# Altium schematic sheet StepperMotorController_Ver_0.1.SchDoc
size A3
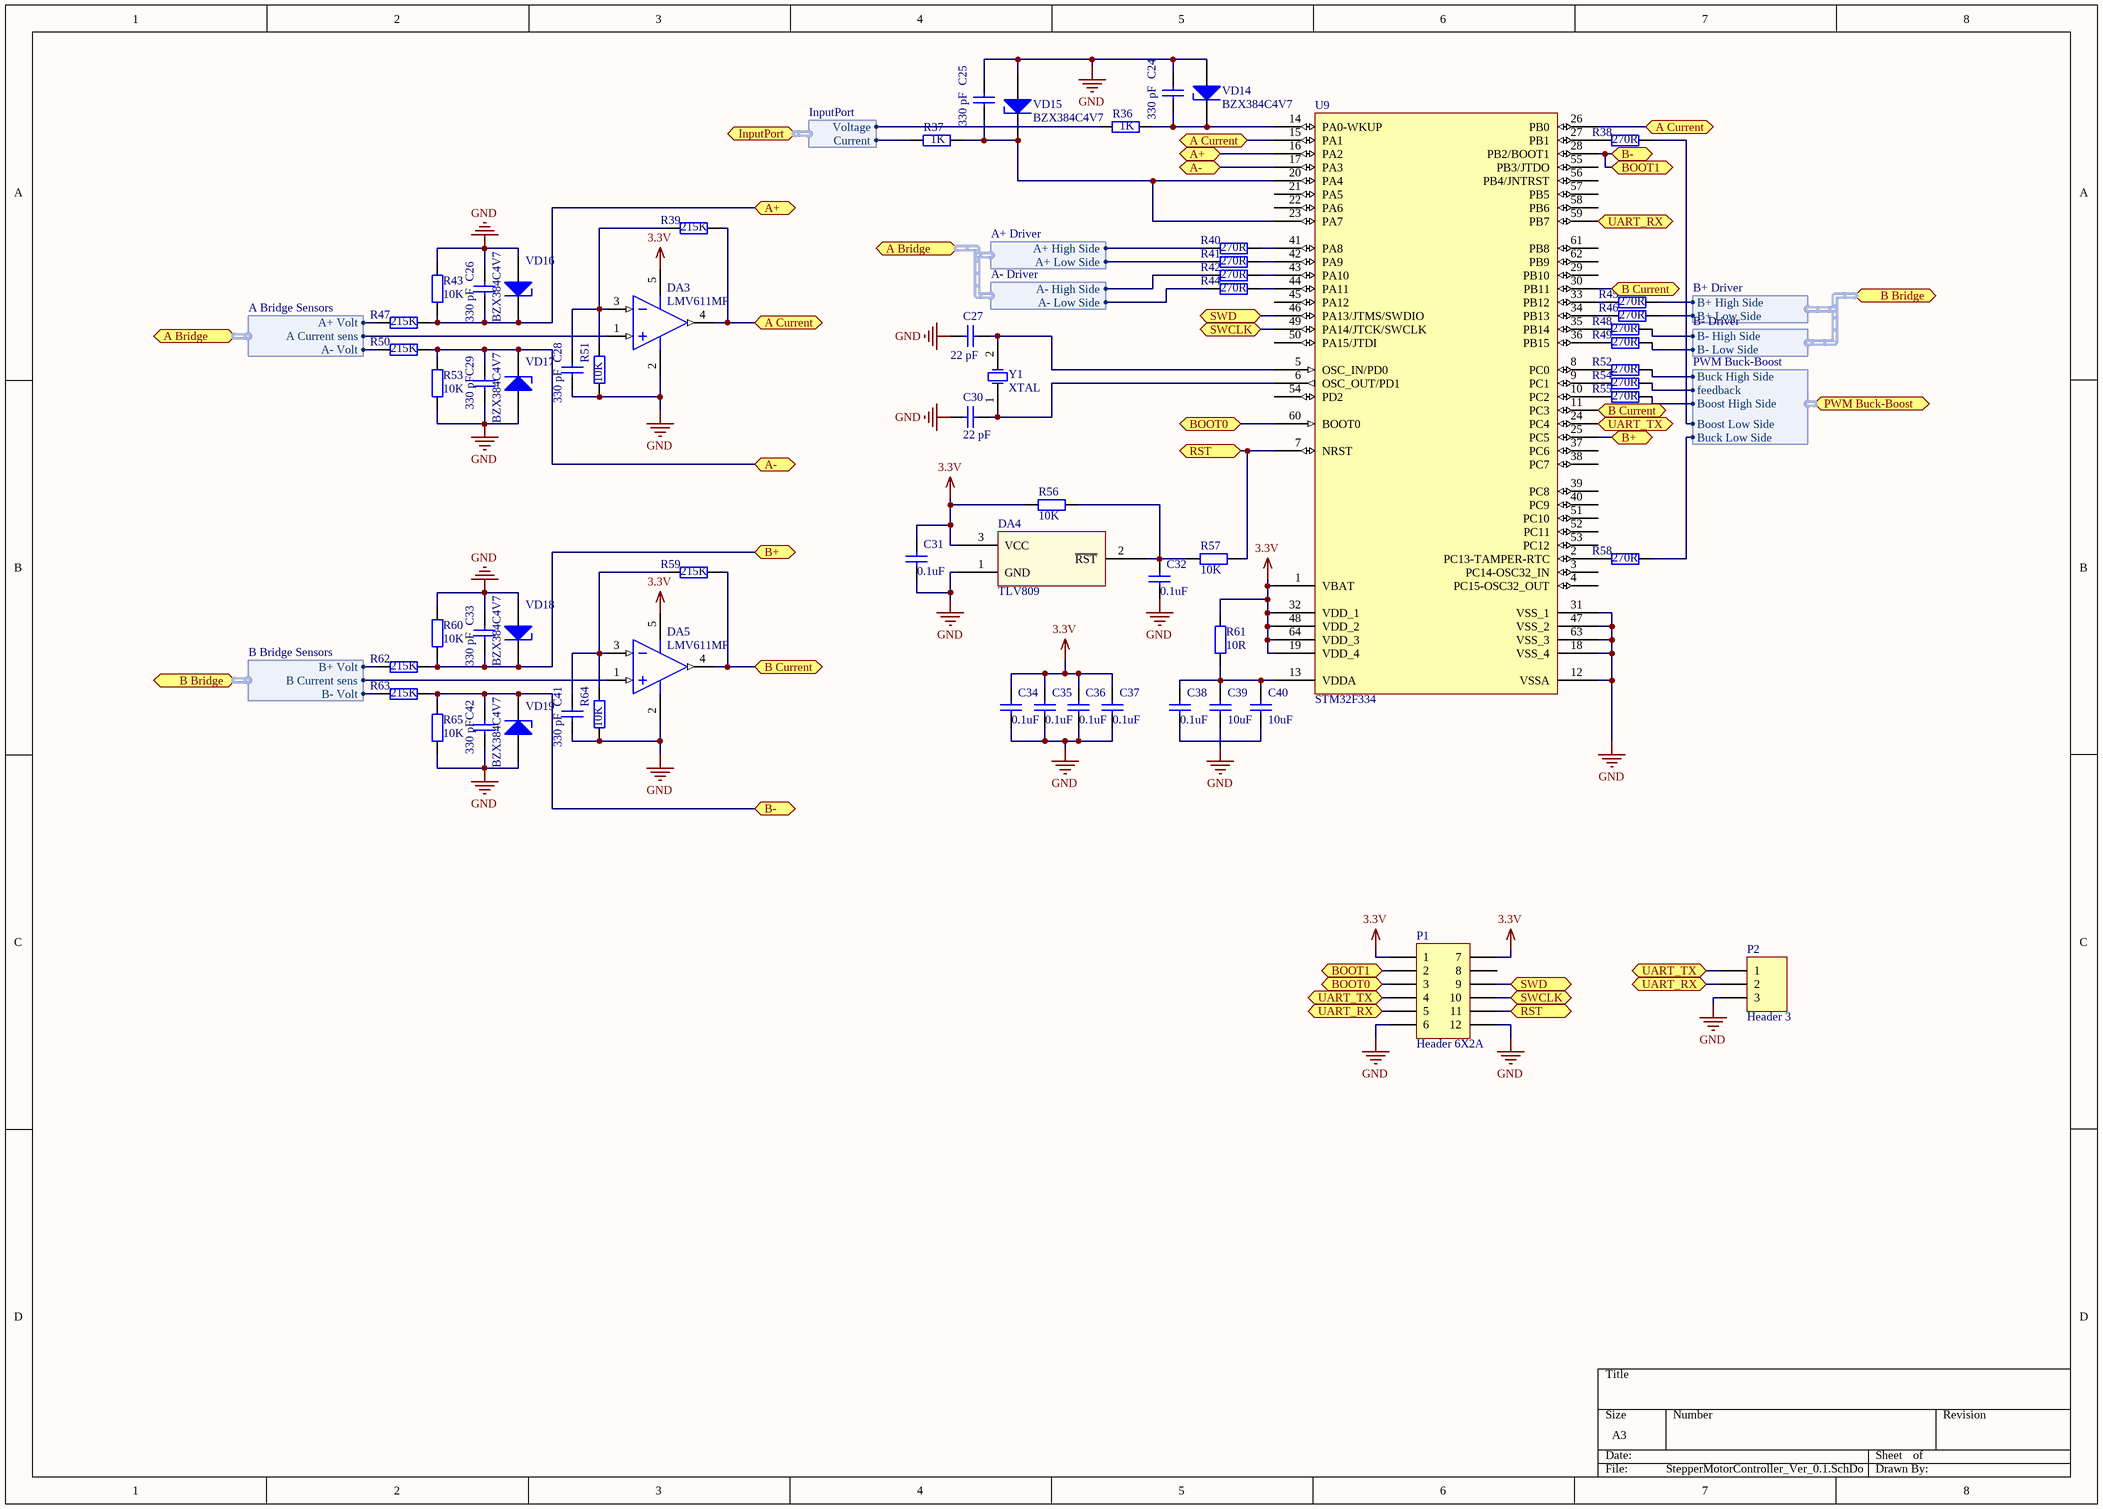
[diagram p0: StepperMotorController_Ver_0.1.SchDoc]

## Parts
C24  value 330 pF  [1608[0603]]  (hidden comment: Capacitor)
C25  value 330 pF  [1608[0603]]  (hidden comment: Capacitor)
C26  value 330 pF  [1608[0603]]  (hidden comment: Capacitor)
C27  value 22 pF  [1608[0603]]  (hidden comment: Capacitor)
C28  value 330 pF  [1608[0603]]  (hidden comment: Capacitor)
C29  value 330 pF  [1608[0603]]  (hidden comment: Capacitor)
C30  value 22 pF  [1608[0603]]  (hidden comment: Capacitor)
C31  value 0.1uF  [1608[0603]]  (hidden comment: Capacitor)
C32  value 0.1uF  [1608[0603]]  (hidden comment: Capacitor)
C33  value 330 pF  [1608[0603]]  (hidden comment: Capacitor)
C34  value 0.1uF  [1608[0603]]  (hidden comment: Capacitor)
C35  value 0.1uF  [1608[0603]]  (hidden comment: Capacitor)
C36  value 0.1uF  [1608[0603]]  (hidden comment: Capacitor)
C37  value 0.1uF  [1608[0603]]  (hidden comment: Capacitor)
C38  value 0.1uF  [1608[0603]]  (hidden comment: Capacitor)
C39  value 10uF  [C1206]  (hidden comment: Capacitor)
C40  value 10uF  [C0805]  (hidden comment: Capacitor)
C41  value 330 pF  [1608[0603]]  (hidden comment: Capacitor)
C42  value 330 pF  [1608[0603]]  (hidden comment: Capacitor)
DA3  LMV611MF  [MF05A_M]
DA4  TLV809  [SOT23]
DA5  LMV611MF  [MF05A_M]
P1  Header 6X2A  [HDR2X6_CEN]
P2  Header 3  [HDR1X3]
R36  value 1K  [J1-0603]  (hidden comment: Resistor)
R37  value 1K  [J1-0603]  (hidden comment: Resistor)
R38  value 270R  [J1-0603]  (hidden comment: Resistor)
R39  value 215K  [J1-0603]  (hidden comment: Resistor)
R40  value 270R  [J1-0603]  (hidden comment: Resistor)
R41  value 270R  [J1-0603]  (hidden comment: Resistor)
R42  value 270R  [J1-0603]  (hidden comment: Resistor)
R43  value 10K  [J1-0603]  (hidden comment: Resistor)
R44  value 270R  [J1-0603]  (hidden comment: Resistor)
R45  value 270R  [J1-0603]  (hidden comment: Resistor)
R46  value 270R  [J1-0603]  (hidden comment: Resistor)
R47  value 215K  [J1-0603]  (hidden comment: Resistor)
R48  value 270R  [J1-0603]  (hidden comment: Resistor)
R49  value 270R  [J1-0603]  (hidden comment: Resistor)
R50  value 215K  [J1-0603]  (hidden comment: Resistor)
R51  value 10K  [J1-0603]  (hidden comment: Resistor)
R52  value 270R  [J1-0603]  (hidden comment: Resistor)
R53  value 10K  [J1-0603]  (hidden comment: Resistor)
R54  value 270R  [J1-0603]  (hidden comment: Resistor)
R55  value 270R  [J1-0603]  (hidden comment: Resistor)
R56  value 10K  [J1-0603]  (hidden comment: Resistor)
R57  value 10K  [J1-0603]  (hidden comment: Resistor)
R58  value 270R  [J1-0603]  (hidden comment: Resistor)
R59  value 215K  [J1-0603]  (hidden comment: Resistor)
R60  value 10K  [J1-0603]  (hidden comment: Resistor)
R61  value 10R  [J1-0603]  (hidden comment: Resistor)
R62  value 215K  [J1-0603]  (hidden comment: Resistor)
R63  value 215K  [J1-0603]  (hidden comment: Resistor)
R64  value 10K  [J1-0603]  (hidden comment: Resistor)
R65  value 10K  [J1-0603]  (hidden comment: Resistor)
U9  STM32F334  [LQFP64_N]
VD14  BZX384C4V7  [SOD323]
VD15  BZX384C4V7  [SOD323]
VD16  BZX384C4V7  [SOD323]
VD17  BZX384C4V7  [SOD323]
VD18  BZX384C4V7  [SOD323]
VD19  BZX384C4V7  [SOD323]
Y1  XTAL  [R38]

## Ports
A Bridge (harness A Bridge Sensors), A Bridge (harness A- Driver), A Current, A+, A-, B Bridge (harness B Bridge Sensors), B Bridge (harness B- Driver), B Current, B+, B-, BOOT0, BOOT1, InputPort (harness InputPort), PWM Buck-Boost (harness PWM Buck-Boost), RST, SWCLK, SWD, UART_RX, UART_TX

## Harnesses
InputPort: Voltage, Current
PWM Buck-Boost: Buck High Side, Buck Low Side, Boost High Side, Boost Low Side, feedback
A+ Driver: A+ High Side, A+ Low Side
A- Driver: A- High Side, A- Low Side
A Bridge Sensors: A+ Volt, A- Volt, A Current sens
B+ Driver: B+ High Side, B+ Low Side
B- Driver: B- High Side, B- Low Side
B Bridge Sensors: B+ Volt, B- Volt, B Current sens

## Nets
3.3V: C31.2 C34.2 C35.2 C36.2 C37.2 DA3.5(V+) DA4.3(VCC) DA5.5(V+) P1.1 P1.7 R56.1 R61.2 U9.1(VBAT) U9.19(VDD_4) U9.32(VDD_1) U9.48(VDD_2) U9.64(VDD_3)
GND: C24.2 C25.2 C26.1 C27.2 C28.2 C29.1 C30.2 C31.1 C32.1 C33.1 C34.1 C35.1 C36.1 C37.1 C39.1 C41.2 C42.1 DA3.2(V-) DA4.1(GND) DA5.2(V-) P1.6 P1.12 P2.3 R43.1 R51.1 R53.1 R60.1 R64.1 R65.1 U9.12(VSSA) U9.18(VSS_4) U9.31(VSS_1) U9.47(VSS_2) U9.63(VSS_3) VD14.2(A) VD15.2(A) VD16.2(A) VD17.2(A) VD18.2(A) VD19.2(A)
A Current: DA3.4(OUT) R39.1 U9.15(PA1) U9.26(PB0) ; port A Current
A+: C26.2 R43.2 R47.1 U9.16(PA2) VD16.1(K) ; port A+
A-: C29.2 R50.1 R53.2 U9.17(PA3) VD17.1(K) ; port A-
B Current: DA5.4(OUT) R59.1 U9.11(PC3) U9.30(PB11) ; port B Current
B+: C33.2 R60.2 R62.1 U9.25(PC5) VD18.1(K) ; port B+
B-: C42.2 P1.2 R63.1 R65.2 U9.28(PB2/BOOT1) VD19.1(K) ; port B-, port BOOT1
BOOT0: P1.3 U9.60(BOOT0) ; port BOOT0
RST: P1.11 R57.2 U9.7(NRST) ; port RST
SWCLK: P1.10 U9.49(PA14/JTCK/SWCLK) ; port SWCLK
SWD: P1.9 U9.46(PA13/JTMS/SWDIO) ; port SWD
UART_RX: P1.5 P2.2 U9.59(PB7) ; port UART_RX
UART_TX: P1.4 P2.1 U9.24(PC4) ; port UART_TX
NetC24_1: C24.1 R36.1 U9.14(PA0-WKUP) VD14.1(K)
NetC25_1: C25.1 R37.1 U9.20(PA4) U9.23(PA7) VD15.1(K)
NetC27_1: C27.1 U9.5(OSC_IN/PD0) Y1.2(OSC2)
NetC28_1: C28.1 DA3.3(IN-) R39.2 R51.2
NetC30_1: C30.1 U9.6(OSC_OUT/PD1) Y1.1(OSC1)
NetC32_2: C32.2 DA4.2(~{RST}) R56.2 R57.1
NetC38_1: C38.1 C40.1
NetC38_2: C38.2 C39.2 C40.2 R61.1 U9.13(VDDA)
NetC41_1: C41.1 DA5.3(IN-) R59.2 R64.2
NetDA3_1: DA3.1(IN+) ; port A Bridge.A Current sens
NetDA5_1: DA5.1(IN+) ; port B Bridge.B Current sens
NetR36_2: R36.2 ; port InputPort.Voltage
NetR37_2: R37.2 ; port InputPort.Current
NetR38_1: R38.1 ; port PWM Buck-Boost.Boost Low Side
NetR38_2: R38.2 U9.27(PB1)
NetR40_1: R40.1 U9.41(PA8)
NetR40_2: R40.2 ; port A Bridge.A+ High Side
NetR41_1: R41.1 U9.42(PA9)
NetR41_2: R41.2 ; port A Bridge.A+ Low Side
NetR42_1: R42.1 U9.43(PA10)
NetR42_2: R42.2 ; port A Bridge.A- High Side
NetR44_1: R44.1 U9.44(PA11)
NetR44_2: R44.2 ; port A Bridge.A- Low Side
NetR45_1: R45.1 ; port B Bridge.B+ High Side
NetR45_2: R45.2 U9.33(PB12)
NetR46_1: R46.1 ; port B Bridge.B+ Low Side
NetR46_2: R46.2 U9.34(PB13)
NetR47_2: R47.2 ; port A Bridge.A+ Volt
NetR48_1: R48.1 ; port B Bridge.B- High Side
NetR48_2: R48.2 U9.35(PB14)
NetR49_1: R49.1 ; port B Bridge.B- Low Side
NetR49_2: R49.2 U9.36(PB15)
NetR50_2: R50.2 ; port A Bridge.A- Volt
NetR52_1: R52.1 ; port PWM Buck-Boost.Buck High Side
NetR52_2: R52.2 U9.8(PC0)
NetR54_1: R54.1 ; port PWM Buck-Boost.feedback
NetR54_2: R54.2 U9.9(PC1)
NetR55_1: R55.1 ; port PWM Buck-Boost.Boost High Side
NetR55_2: R55.2 U9.10(PC2)
NetR58_1: R58.1 ; port PWM Buck-Boost.Buck Low Side
NetR58_2: R58.2 U9.2(PC13-TAMPER-RTC)
NetR62_2: R62.2 ; port B Bridge.B+ Volt
NetR63_2: R63.2 ; port B Bridge.B- Volt

Not connected (* = marked no-connect by the designer): P1 8; U9 3(PC14-OSC32_IN) 4(PC15-OSC32_OUT) 21(PA5) 22(PA6) 29(PB10) 37(PC6) 38(PC7) 39(PC8) 40(PC9) 45(PA12) 50(PA15/JTDI) 51(PC10) 52(PC11) 53(PC12) 54(PD2) 55(PB3/JTDO) 56(PB4/JNTRST) 57(PB5) 58(PB6) 61(PB8) 62(PB9)

## Library data of the parts
DA3 DA5 = LMV611MF: Low Power Single Op Amp, 5-pin SOT-23; PartNumber: LM321MF; Manufacturer: National Semiconductor; PackageTopMarking: A63A*XTT; PowerWise: N; CompType: Amplifiers; Published: 4-Dec-2008; LatestRevisionDate: 13-Jan-2009; LatestRevisionNote: Sim Model Added.; DatasheetVersion: Apr-2001; PackageVersion: revD, Aug-2008; PackageReference: MF05A; Publisher: Altium Limited; PackageDescription: Molded SOT-23, .115 x .063 x .040 in Body, 5 Lead, .0375 in Pitch; Supplier 1: Farnell; Supplier Part Number 1: 9779116RL; Supplier 2: Farnell; Supplier Part Number 2: 9779116; RoHS: N; PinCount: 5; ComponentLink1Description: LM321 Datasheet; ComponentLink1URL: http://www.national.com/ds/LM/LM321.pdf; ComponentLink2Description: LM321 Web Page; ComponentLink2URL: http://www.national.com/pf/LM/LM321.html; ComponentLink3Description: MF05A Package Page; ComponentLink3URL: http://www.national.com/packaging/folders/mf05a.html
DA4 = TLV809: SuperVisor TI
P1 = Header 6X2A: Header, 6-Pin, Dual row; LatestRevisionDate: 17-Jul-2002; LatestRevisionNote: Re-released for DXP Platform.; Publisher: Altium Limited
P2 = Header 3: Header, 3-Pin; LatestRevisionDate: 17-Jul-2002; LatestRevisionNote: Re-released for DXP Platform.; Publisher: Altium Limited
U9 = STM32F103RBT6: STM32 ARM-based 32-bit MCU with 128 Kbytes Flash, 64-pin LQFP, Industrial Temperature; Published: 30-May-2008; DatasheetVersion: rev6, Mar-2008; PackageVersion: Mar-2008; PackageReference: LQFP64; Publisher: Altium Limited; PackageDescription: 64-Pin Low-Profile Quad Flat Pack, 10 x 10 mm Body, 0.5 mm Pitch (LQFP64); ComponentLink1Description: Manufacturer Link; ComponentLink1URL: www.st.com/stm32; ComponentLink2Description: Datasheet; ComponentLink2URL: http://www.st.com/stonline/products/literature/ds/13587.pdf
VD14-VD19 = BZX384C5V6: Zenner Diode; Published: 17-Sep-2003; LatestRevisionDate: 19-Mar-2004; LatestRevisionNote: Silkscreen size reduced.; DatasheetVersion: 14-Oct-1996; PackageVersion: May-1999; PackageReference: SOD323; Publisher: Altium Limited; PackageDescription: SOD-323/SC-76; 2 Leads; Body 1.7 x 1.3 mm, (LxW); ComponentLink1Description: Manufacturer Link; ComponentLink1URL: http://www.semiconductors.philips.com/; ComponentLink2Description: Datasheet; ComponentLink2URL: http://www.semiconductors.philips.com/acrobat/datasheets/1PS76SB10_2.pdf
Y1 = XTAL: Crystal Oscillator; Published: 8-Jun-2000; LatestRevisionDate: 17-Jul-2002; LatestRevisionNote: Re-released for DXP Platform.; PackageReference: R38; Publisher: Altium Limited; PackageDescription: Crystal, Thru-Hole; 2 Leads; Body 3.1 x 8.2 mm (Dia.xH)
C24-C42 = Capacitor: Published: 8-Jun-2000; LatestRevisionDate: 17-Jul-2002; LatestRevisionNote: Re-released for DXP Platform.; PackageReference: RAD-0.3; Publisher: Altium Limited; PackageDescription: Radial Cap, Thru-Hole; 2 Leads; 0.3 in Pin Spacing
R36-R65 = Resistor: Published: 8-Jun-2000; LatestRevisionDate: 17-Jul-2002; LatestRevisionNote: Re-released for DXP Platform.; PackageReference: AXIAL-0.4; Publisher: Altium Limited; PackageDescription: Axial Device, Thru-Hole; 2 Leads; 0.4 in Pin Spacing